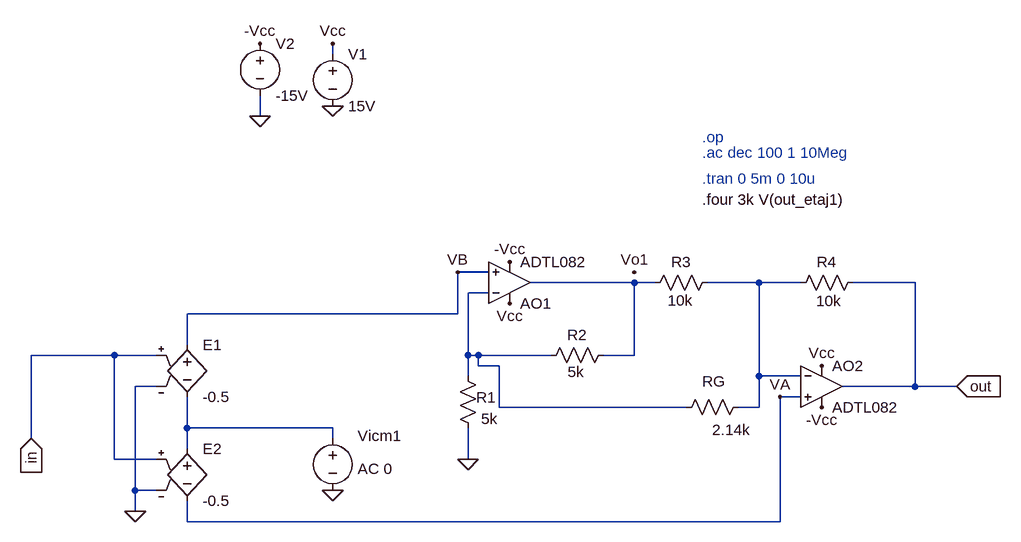
[diagram p0: schematic etaj1.asc]
etaj1.asc, the LTspice schematic file:
Version 4
SHEET 1 2684 1568
WIRE -336 -288 -336 -304
WIRE -448 -192 -448 -224
WIRE -96 48 -144 48
WIRE 128 64 -32 64
WIRE 160 64 128 64
WIRE 320 64 240 64
WIRE 384 64 320 64
WIRE 560 64 464 64
WIRE -96 80 -128 80
WIRE -144 112 -144 48
WIRE -144 112 -560 112
WIRE -560 160 -560 112
WIRE -672 176 -800 176
WIRE -608 176 -672 176
WIRE -128 176 -128 80
WIRE -112 176 -128 176
WIRE 0 176 -112 176
WIRE 128 176 128 64
WIRE 128 176 80 176
WIRE -112 192 -112 176
WIRE -80 192 -112 192
WIRE -128 208 -128 176
WIRE 320 208 320 64
WIRE 384 208 320 208
WIRE -608 224 -640 224
WIRE 560 224 560 64
WIRE 560 224 448 224
WIRE 624 224 560 224
WIRE 384 240 352 240
WIRE -80 256 -80 192
WIRE 208 256 -80 256
WIRE 320 256 320 208
WIRE 320 256 288 256
WIRE -560 288 -560 240
WIRE -336 288 -560 288
WIRE -800 304 -800 176
WIRE -336 304 -336 288
WIRE -560 320 -560 288
WIRE -672 336 -672 176
WIRE -608 336 -672 336
WIRE -128 336 -128 288
WIRE -640 384 -640 224
WIRE -608 384 -640 384
WIRE -640 416 -640 384
WIRE -560 432 -560 400
WIRE 352 432 352 240
WIRE 352 432 -560 432
FLAG 128 48 Vo1
FLAG -128 336 0
FLAG -144 48 VB
FLAG 352 240 VA
FLAG -448 -304 -Vcc
FLAG -336 -304 Vcc
FLAG -64 32 -Vcc
FLAG 416 256 -Vcc
FLAG -64 96 Vcc
FLAG 416 192 Vcc
FLAG 624 224 out
IOPIN 624 224 In
FLAG -336 -208 0
FLAG -448 -192 0
FLAG -640 416 0
FLAG -336 384 0
FLAG -800 304 in
IOPIN -800 304 In
DATAFLAG 560 224 ""
DATAFLAG 560 224 ""
SYMBOL res 256 48 R90
WINDOW 0 0 56 VBottom 2
WINDOW 3 59 57 VBottom 2
SYMATTR InstName R3
SYMATTR Value 10k
SYMBOL res 480 48 R90
WINDOW 0 0 56 VBottom 2
WINDOW 3 60 53 VBottom 2
SYMATTR InstName R4
SYMATTR Value 10k
SYMBOL res 304 240 R90
WINDOW 0 -8 54 VBottom 2
WINDOW 3 51 56 VLeft 2
SYMATTR InstName RG
SYMATTR Value 2.14k
SYMBOL res 96 160 R90
WINDOW 0 0 56 VBottom 2
WINDOW 3 57 58 VBottom 2
SYMATTR InstName R2
SYMATTR Value 5k
SYMBOL OpAmps\\ADTL082 416 160 R0
SYMATTR InstName AO2
SYMBOL OpAmps\\ADTL082 -64 128 M180
SYMATTR InstName AO1
SYMBOL res -144 192 R0
WINDOW 0 29 49 Left 2
WINDOW 3 36 82 Left 2
SYMATTR InstName R1
SYMATTR Value 5k
SYMBOL voltage -336 -304 R0
WINDOW 123 0 0 Left 2
WINDOW 39 0 0 Left 2
SYMATTR InstName V1
SYMATTR Value 15V
SYMBOL voltage -448 -320 R0
WINDOW 123 0 0 Left 2
WINDOW 39 0 0 Left 2
SYMATTR InstName V2
SYMATTR Value -15V
SYMBOL e -560 144 R0
SYMATTR InstName E1
SYMATTR Value -0.5
SYMBOL e -560 304 R0
SYMATTR InstName E2
SYMATTR Value -0.5
SYMBOL voltage -336 288 R0
WINDOW 123 38 63 Left 2
WINDOW 39 0 0 Left 2
WINDOW 0 38 12 Left 2
WINDOW 3 -188 38 Left 2
SYMATTR Value2 AC 0
SYMATTR InstName Vicm1
SYMATTR Value ""
TEXT 232 -160 Left 2 ;.op
TEXT 232 -136 Left 2 ;.ac dec 100 1 10Meg
TEXT 232 -96 Left 2 ;.tran 0 5m 0 10u
TEXT 232 -64 Left 2 !.four 3k V(out_etaj1)

The netlist it stands for:
* etaj1.asc
R3 N002 N001 10k
R4 out N002 10k
RG N002 N003 2.14k
R2 N001 N003 5k
XAO2 VA N002 Vcc -Vcc out ADTL082  ; pins In+ In- V+ V- OUT
XAO1 VB N003 Vcc -Vcc N001 ADTL082  ; pins In+ In- V+ V- OUT
R1 N003 0 5k
V1 Vcc 0 15V
V2 -Vcc 0 -15V
E1 VB N004 in 0 -0.5
E2 N004 VA in 0 -0.5
Vicm1 N004 0 AC 0
* .op
* .ac dec 100 1 10Meg
* .tran 0 5m 0 10u
.four 3k V(out_etaj1)
.lib ADI.lib
.backanno
.end